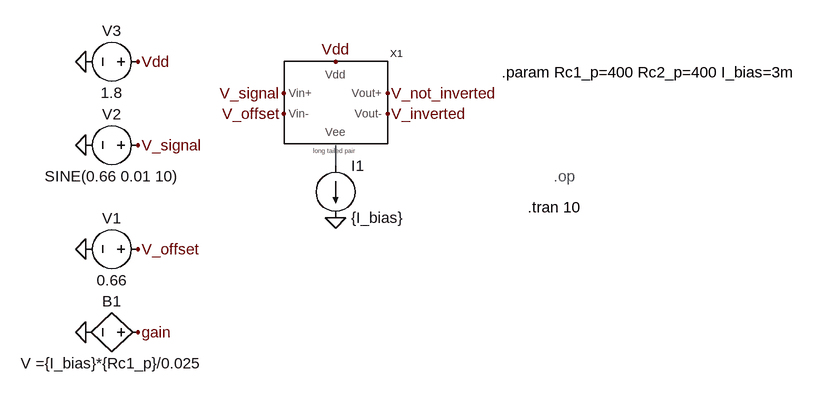
[diagram p0: schematic differential_amplifier_sim.asc]
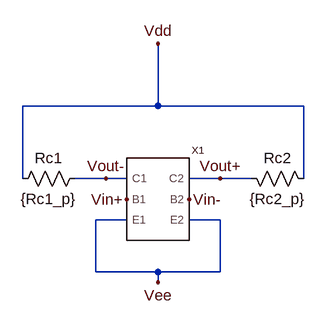
[diagram p1: sub-circuit long_tailed_pair.asc]
differential_amplifier_sim.asc, the LTspice schematic file:
Version 4.1
SHEET 1 1096 680
WIRE 224 208 224 176
FLAG 224 48 Vdd
FLAG -160 176 0
FLAG -80 176 V_signal
FLAG 144 96 V_signal
FLAG 304 128 V_inverted
FLAG 224 288 0
FLAG -160 336 0
FLAG -80 336 V_offset
FLAG 144 128 V_offset
FLAG 304 96 V_not_inverted
FLAG -160 48 0
FLAG -80 48 Vdd
FLAG -160 464 0
FLAG -80 464 gain
SYMBOL long_tailed_pair 224 112 R0
SYMATTR InstName X1
SYMBOL voltage -64 176 R90
WINDOW 0 -32 56 VBottom 2
WINDOW 3 32 56 VTop 2
WINDOW 123 0 0 Left 0
WINDOW 39 0 0 Left 0
SYMATTR InstName V2
SYMATTR Value SINE(0.66 0.01 10)
SYMBOL current 224 208 R0
WINDOW 123 0 0 Left 0
WINDOW 39 0 0 Left 0
SYMATTR InstName I1
SYMATTR Value {I_bias}
SYMBOL voltage -64 336 R90
WINDOW 0 -32 56 VBottom 2
WINDOW 3 32 56 VTop 2
WINDOW 123 0 0 Left 0
WINDOW 39 0 0 Left 0
SYMATTR InstName V1
SYMATTR Value 0.66
SYMBOL voltage -64 48 M270
WINDOW 0 32 56 VTop 2
WINDOW 3 -32 56 VBottom 2
SYMATTR InstName V3
SYMATTR Value 1.8
SYMBOL bv -64 464 R90
WINDOW 0 -32 56 VBottom 2
WINDOW 3 32 56 VTop 2
SYMATTR InstName B1
SYMATTR Value V ={I_bias}*{Rc1_p}/0.025
TEXT 520 272 Left 2 !.tran 10
TEXT 480 64 Left 2 !.param Rc1_p=400 Rc2_p=400 I_bias=3m
TEXT 560 224 Left 2 ;.op

long_tailed_pair.asc, the sub-circuit schematic file:
Version 4.1
SHEET 1 1140 680
WIRE 208 32 208 -64
WIRE 208 32 0 32
WIRE 432 32 208 32
WIRE 0 144 0 32
WIRE 128 144 80 144
WIRE 160 144 128 144
WIRE 304 144 256 144
WIRE 352 144 304 144
WIRE 432 144 432 32
WIRE 160 208 112 208
WIRE 304 208 256 208
WIRE 112 288 112 208
WIRE 208 288 112 288
WIRE 304 288 304 208
WIRE 304 288 208 288
WIRE 208 304 208 288
FLAG 208 -64 Vdd
FLAG 160 176 Vin+
FLAG 256 176 Vin-
FLAG 208 304 Vee
FLAG 128 144 Vout-
FLAG 304 144 Vout+
SYMBOL res 96 128 R90
WINDOW 0 0 56 VBottom 2
WINDOW 3 32 56 VTop 2
SYMATTR InstName Rc1
SYMATTR Value {Rc1_p}
SYMBOL res 336 128 M90
WINDOW 0 0 56 VBottom 2
WINDOW 3 32 56 VTop 2
SYMATTR InstName Rc2
SYMATTR Value {Rc2_p}
SYMBOL BCM847BS_pair 224 176 R0
SYMATTR InstName X1

The netlist it stands for:
* differential_amplifier_sim.asc
X§X1 Vdd V_signal V_offset N001 V_not_inverted V_inverted long_tailed_pair
V2 V_signal 0 SINE(0.66 0.01 10)
I1 N001 0 {I_bias}
V1 V_offset 0 0.66
V3 Vdd 0 1.8
B1 gain 0 V ={I_bias}*{Rc1_p}/0.025

* block symbol definitions
.subckt long_tailed_pair Vdd Vin+ Vin- Vee Vout+ Vout-
Rc1 Vout- Vdd {Rc1_p}
Rc2 Vout+ Vdd {Rc2_p}
X§X1 Vout- Vin+ Vee Vout+ Vin- Vee BCM847BS_pair  ; pins C1 B1 E1 C2 B2 E2
.ends long_tailed_pair

.tran 10
.param Rc1_p=400 Rc2_p=400 I_bias=3m
* .op
.backanno
.end